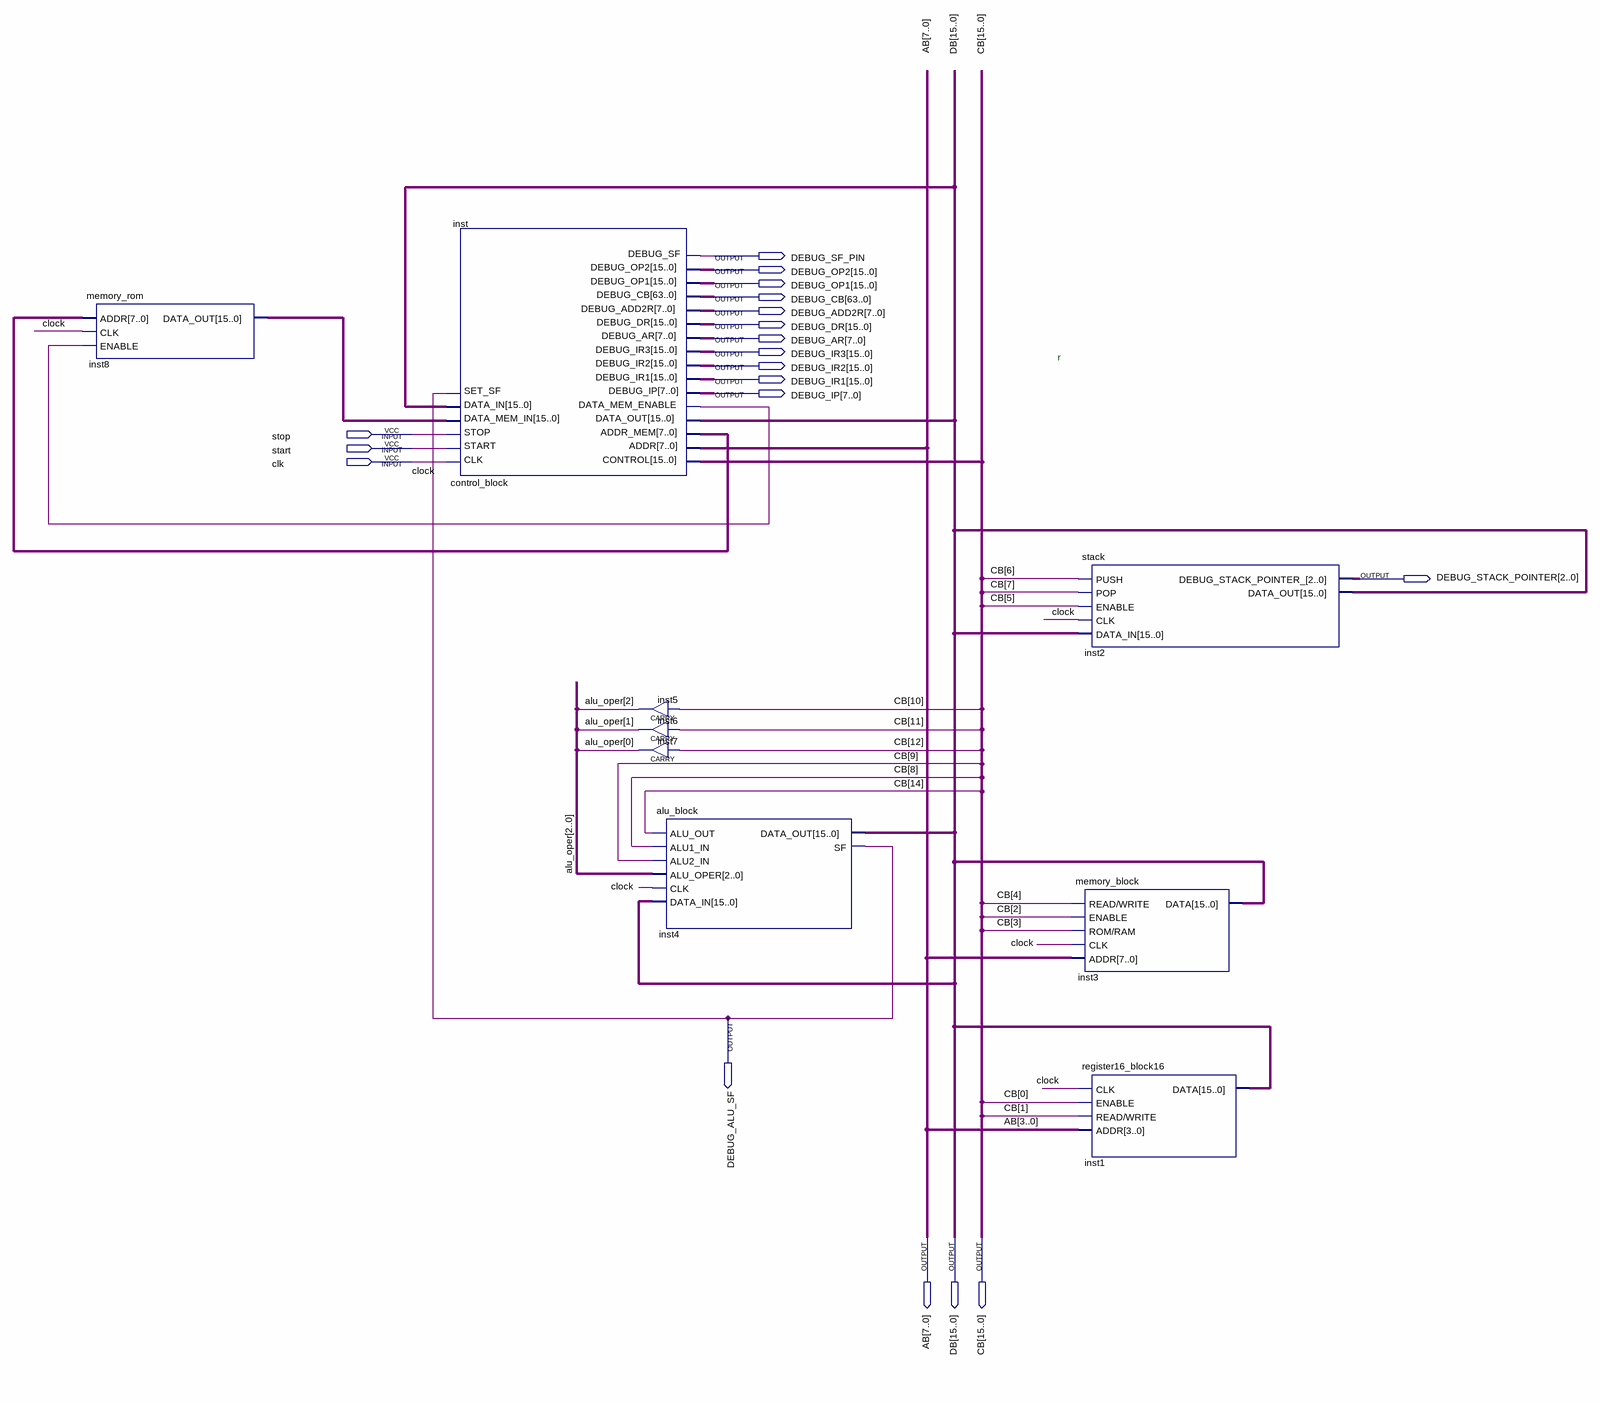
[diagram p0: schematic sheet]
// Quartus schematic cpu.bdf as structural Verilog: 9 symbols, 19 pins
module cpu (
  input  stop,
  input  start,
  input  clk,
  output DEBUG_SF_PIN,
  output [15:0] DEBUG_OP2,
  output [15:0] DEBUG_OP1,
  output [63:0] DEBUG_CB,
  output [7:0] DEBUG_ADD2R,
  output [15:0] DEBUG_DR,
  output [7:0] DEBUG_AR,
  output [15:0] DEBUG_IR3,
  output [15:0] DEBUG_IR2,
  output [15:0] DEBUG_IR1,
  output [7:0] DEBUG_IP,
  output [2:0] DEBUG_STACK_POINTER,
  output DEBUG_ALU_SF,
  output [7:0] AB,
  output [15:0] DB,
  output [15:0] CB
);

  wire inst_data_mem_enable;
  wire [2:0] alu_oper;
  wire [7:0] inst_addr_mem;
  wire [15:0] inst8_data_out;

  memory_rom inst8 (.ADDR(inst_addr_mem), .CLK(clk), .ENABLE(inst_data_mem_enable), .DATA_OUT(inst8_data_out));
  control_block inst (
    .CLK(clk), .START(start), .STOP(stop), .DATA_MEM_IN(inst8_data_out), .DATA_IN(DB), .SET_SF(DEBUG_ALU_SF),
    .CONTROL(CB), .ADDR(AB), .ADDR_MEM(inst_addr_mem), .DATA_OUT(DB), .DATA_MEM_ENABLE(inst_data_mem_enable),
    .DEBUG_IP(DEBUG_IP), .DEBUG_IR1(DEBUG_IR1), .DEBUG_IR2(DEBUG_IR2), .DEBUG_IR3(DEBUG_IR3),
    .DEBUG_AR(DEBUG_AR), .DEBUG_DR(DEBUG_DR), .DEBUG_ADD2R(DEBUG_ADD2R), .DEBUG_CB(DEBUG_CB),
    .DEBUG_OP1(DEBUG_OP1), .DEBUG_OP2(DEBUG_OP2), .DEBUG_SF(DEBUG_SF_PIN));
  CARRY inst5 (.IN(CB[10]), .OUT(alu_oper[2]));
  CARRY inst6 (.IN(CB[11]), .OUT(alu_oper[1]));
  CARRY inst7 (.IN(CB[12]), .OUT(alu_oper[0]));
  alu_block inst4 (
    .ALU_OUT(CB[14]), .ALU1_IN(CB[8]), .ALU2_IN(CB[9]), .ALU_OPER(alu_oper), .CLK(clk), .DATA_IN(DB),
    .DATA_OUT(DB), .SF(DEBUG_ALU_SF));
  stack inst2 (
    .PUSH(CB[6]), .POP(CB[7]), .ENABLE(CB[5]), .CLK(clk), .DATA_IN(DB),
    .DEBUG_STACK_POINTER_(DEBUG_STACK_POINTER), .DATA_OUT(DB));
  memory_block inst3 (.\READ/WRITE (CB[4]), .ENABLE(CB[2]), .\ROM/RAM (CB[3]), .CLK(clk), .ADDR(AB), .DATA(DB));
  register16_block16 inst1 (.CLK(clk), .ENABLE(CB[0]), .\READ/WRITE (CB[1]), .ADDR(AB[3:0]), .DATA(DB));

  // Other names for the same wires on the sheet: clock = clk

  // Notes on the sheet:
  //   r
endmodule
